# Altium schematic sheet I2C.SchDoc: COMMUNICATION I2C
size A4; CheckedBy: P. FISCHER; Author: J-E GBAYEWO; CompanyName: LE GROUPE DE 5; DrawnBy: J-E GBAYEWO; DocumentNumber: SCH_CARTE_MONITORING_PERMANENT_0; Revision: A.0; SheetNumber: 7; SheetTotal: 7
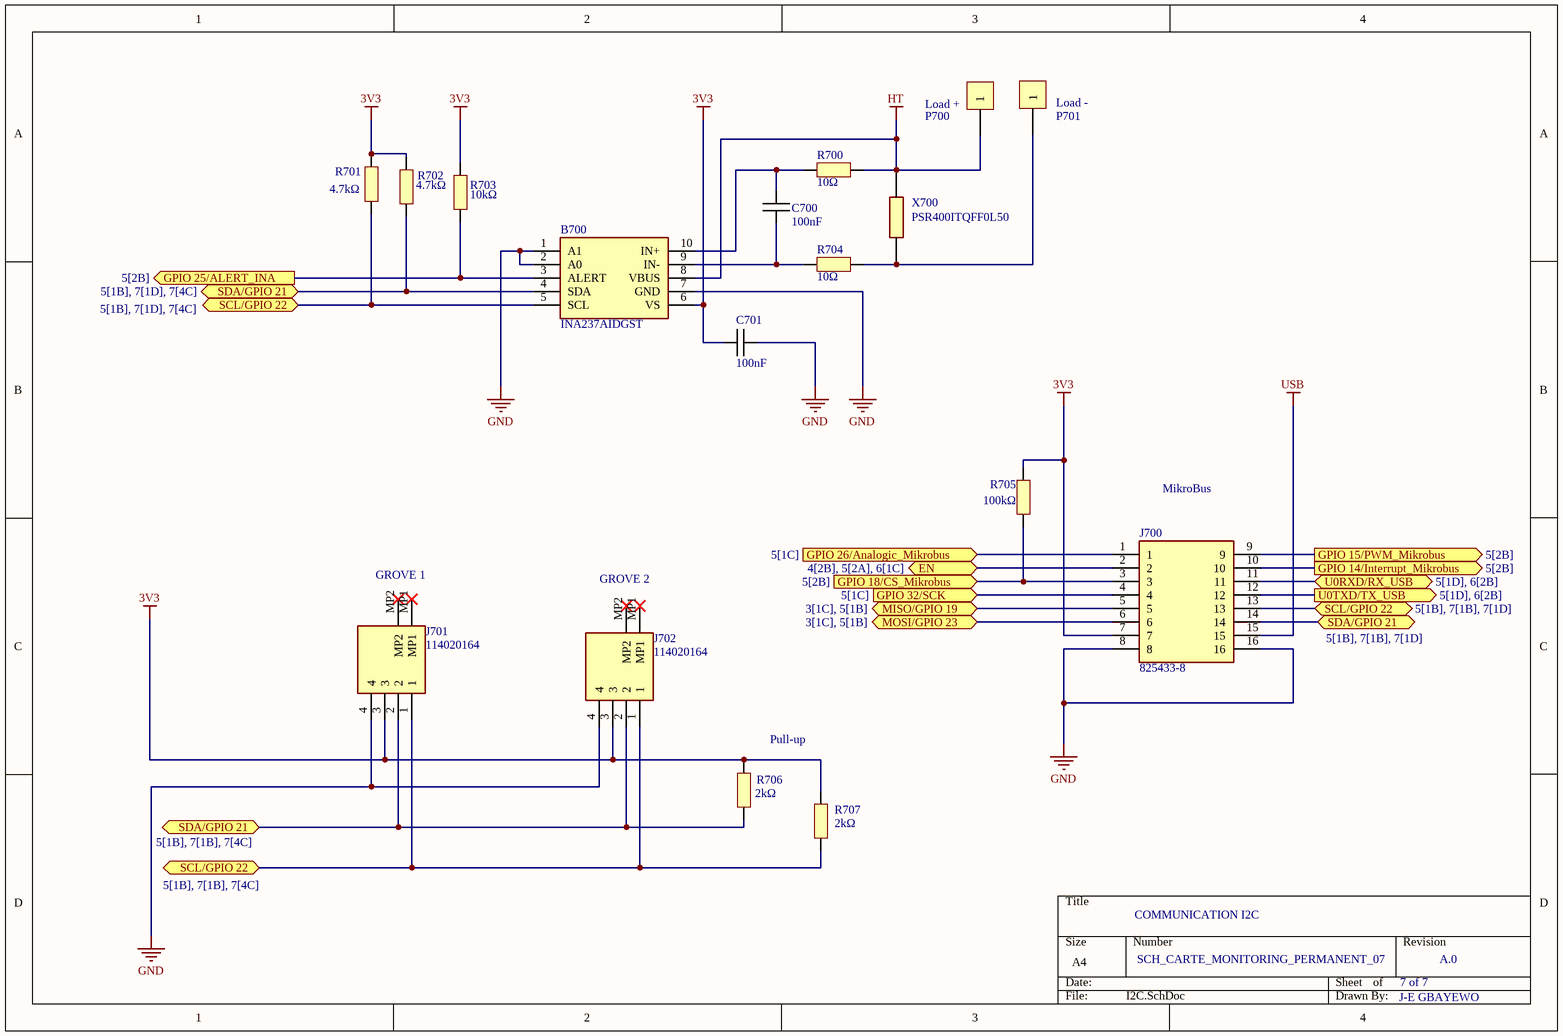
[diagram p0: I2C.SchDoc]

## Parts
B700  INA237AIDGST  [SOP50P490X110-10N]
C700  100nF  [CAPC1005X06N]
C701  100nF  [CAPC1005X06N]
J700  825433-8  [Connect-Mikrobus]
J701  114020164  [114020164]
J702  114020164  [114020164]
P700  Plage CMS 10x5  [Plage CMS 10x5]  (value not drawn)  (no BOM)
P701  Plage CMS 10x5  [Plage CMS 10x5]  (value not drawn)  (no BOM)
R700  10Ω  [RESC1005X06N]
R701  4.7kΩ  [RESC1005X06N]
R702  4.7kΩ  [RESC1005X06N]
R703  10kΩ  [RESC1005X06N]
R704  10Ω  [RESC1005X06N]
R705  100kΩ  [RESC1005X06N]
R706  2kΩ  [RESC1005X06N]
R707  2kΩ  [RESC1005X06N]
X700  PSR400ITQFF0L50  [RESC10052X200N]

## Ports
EN (bidir, see 4[2B], 5[2A], 6[1C]), GPIO 14/Interrupt_Mikrobus (out, see 5[2B]), GPIO 15/PWM_Mikrobus (out, see 5[2B]), GPIO 18/CS_Mikrobus (in, see 5[2B]), GPIO 25/ALERT_INA (out, see 5[2B]), GPIO 26/Analogic_Mikrobus (in, see 5[1C]), GPIO 32/SCK (in, see 5[1C]), MISO/GPIO 19 (bidir, see 3[1C], 5[1B]), MOSI/GPIO 23 (bidir, see 3[1C], 5[1B]), SCL/GPIO 22 (bidir, see 5[1B], 7[1B], 7[1D]), SCL/GPIO 22 (bidir, see 5[1B], 7[1B], 7[4C]), SCL/GPIO 22 (bidir, see 5[1B], 7[1D], 7[4C]), SDA/GPIO 21 (bidir, see 5[1B], 7[1B], 7[1D]), SDA/GPIO 21 (bidir, see 5[1B], 7[1B], 7[4C]), SDA/GPIO 21 (bidir, see 5[1B], 7[1D], 7[4C]), U0RXD/RX_USB (bidir, see 5[1D], 6[2B]), U0TXD/TX_USB (out, see 5[1D], 6[2B])

## Nets
3V3: B700.6(VS) C701.1 J700.7 J701.3 J702.3 R701.1 R702.1 R703.2 R705.2 R706.1 R707.1
GND: B700.1(A1) B700.2(A0) B700.7(GND) C701.2 J700.8 J700.16 J701.4 J702.4
HT: B700.8(VBUS) P700.1 R700.2 X700.2
USB: J700.15
EN: J700.2 ; port EN
GPIO 14/Interrupt_Mikrobus: J700.10 ; port GPIO 14/Interrupt_Mikrobus
GPIO 15/PWM_Mikrobus: J700.9 ; port GPIO 15/PWM_Mikrobus
GPIO 18/CS_Mikrobus: J700.3 R705.1 ; port GPIO 18/CS_Mikrobus
GPIO 25/ALERT_INA: B700.3(ALERT) R703.1 ; port GPIO 25/ALERT_INA
GPIO 26/Analogic_Mikrobus: J700.1 ; port GPIO 26/Analogic_Mikrobus
GPIO 32/SCK: J700.4 ; port GPIO 32/SCK
MISO/GPIO 19: J700.5 ; port MISO/GPIO 19
MOSI/GPIO 23: J700.6 ; port MOSI/GPIO 23
SCL/GPIO 22: B700.5(SCL) J700.13 J701.1 J702.1 R701.2 R707.2 ; port SCL/GPIO 22
SDA/GPIO 21: B700.4(SDA) J700.14 J701.2 J702.2 R702.2 R706.2 ; port SDA/GPIO 21
U0RXD/RX_USB: J700.11 ; port U0RXD/RX_USB
U0TXD/TX_USB: J700.12 ; port U0TXD/TX_USB
NetB700_9: B700.9(IN-) C700.2 R704.1
NetB700_10: B700.10(IN+) C700.1 R700.1
NetP701_1: P701.1 R704.2 X700.1

Not connected (* = marked no-connect by the designer): J701 MP1* MP2*; J702 MP1* MP2*

## Notes on the sheet
- (near P700) Load +
- (near P701) Load -
- MikroBus
- (near J701) GROVE 1
- (near J702) GROVE 2
- Pull-up

## Library data of the parts
B700 = INA237AIDGST: Current Sense Amplifiers 85-V, 16-bit, I2C output current/voltage/power monitor with alert 10-VSSOP -40 to 125; Manufacturer_Name: Texas Instruments; Manufacturer_Part_Number: INA237AIDGST; Mouser Part Number: 595-INA237AIDGST
C700 C701 = Capacitor
J700 = Connect-Mikrobus: Headers & Wire Housings 8P double for connection mikrobus; Manufacturer_Name: TE Connectivity; Manufacturer_Part_Number: 825433-8; Mouser Part Number: 571-825433-8
J701 J702 = 114020164: Seeed Studio Accessories Grove Female Header - SMD-4P-2.0mm-90D-20Pcs; Manufacturer_Name: Seeed Studio; Manufacturer_Part_Number: 114020164; Mouser Part Number: 713-114020164
P700 P701 = Plage CMS 10x5: Plage de report CMS 10x5mm; PN: L30; Value: Plage CMS 10x5; Footprint_statut: ok
R700-R707 = Resistor
X700 = PSR400ITQFF0L50: ROHM - PSR400ITQFF0L50 - SMD Current Sense Resistor, 500 ohm, PSR Series, 3921 [1052 Metric], 4 W, +/- 1%, Metal Strip; Manufacturer_Name: ROHM Semiconductor; Geometry.Height: 2mm; Manufacturer_Part_Number: PSR400ITQFF0L50; Mouser Part Number: 755-PSR400ITQFF0L50; Mouser Price/Stock: https://www.mouser.co.uk/ProductDetail/ROHM-Semiconductor/PSR400ITQFF0L50?qs=493kPxzlxfLaT1w5Mo%252BtHg%3D%3D; Arrow Part Number: *; Arrow Price/Stock: *; Datasheet Link: https://componentsearchengine.com/Datasheets/2/PSR400ITQFF0L50.pdf